# EAGLE schematic fanproject (EAGLE 9.6.0)
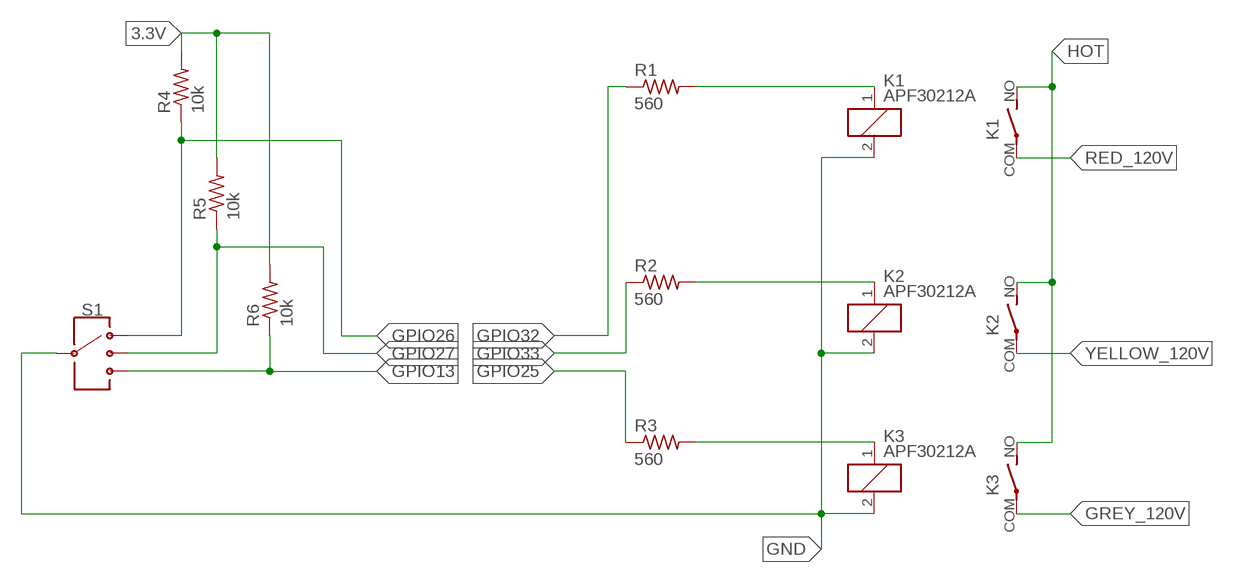
[diagram p0: schematic, sheet 1]

## Parts
K1  APF30212A  [APF30212A]
K2  APF30212A  [APF30212A]
K3  APF30212A  [APF30212A]
R1  560  R-US_0204/2V  [0204V]
R2  560  R-US_0204/2V  [0204V]
R3  560  R-US_0204/2V  [0204V]
R4  10k  R-US_0204/2V  [0204V]
R5  10k  R-US_0204/2V  [0204V]
R6  10k  R-US_0204/2V  [0204V]
S1  SWITCH-SP3T-SMD  [SWITCH_SP3T_SMD]

## Nets
3.3V: R4.2 R5.2 R6.2
GND: K1.2 K2.2 K3.2 S1.3
GPIO13: R6.1 S1.4
GPIO25: R3.1
GPIO26: R4.1 S1.1
GPIO27: R5.1 S1.2
GPIO32: R1.1
GPIO33: R2.1
GREY_120V: K3.COM(2:P)
HOT: K1.NO(2:S) K2.NO(2:S) K3.NO(2:S)
N$1: K1.1 R1.2
N$2: K2.1 R2.2
N$3: K3.1 R3.2
RED_120V: K1.COM(2:P)
YELLOW_120V: K2.COM(2:P)

## Library data of the parts
K1-K3 = relay:APF30212A: Compliant with European standards 1a/1c 6A Slim power relays Source: Data sheet <http://pewa.panasonic.com/assets/pcsd/catalog/pf-catalog.pdf>; OC_FARNELL: unknown
R1-R6 = adafruit:R-US_: RESISTOR, American symbol
S1 = SparkFun-Switches:SWITCH-SP3T: Single-Pole, Triple-Throw (SP3T) Switch Single-Pole, Triple-Throw switches SparkFun Products Prototype Part; PROD_ID: SWCH-10805